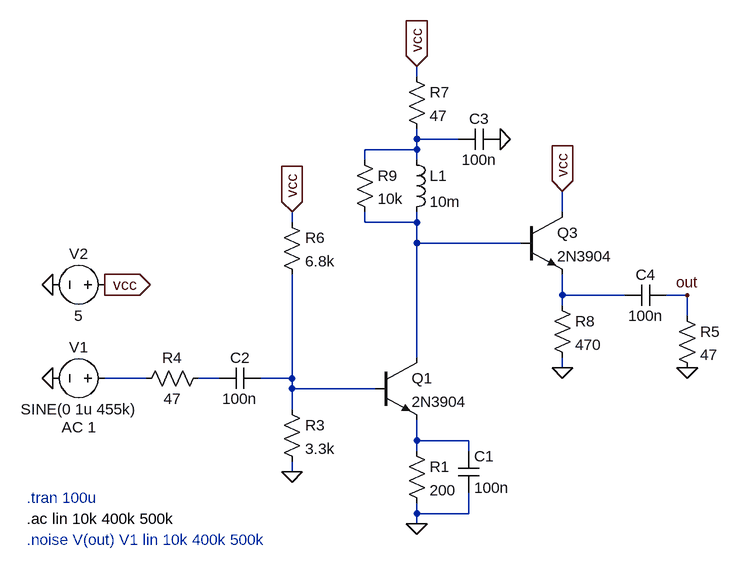
[diagram p0: schematic lc-tank.asc]
lc-tank.asc, the LTspice schematic file:
Version 4
SHEET 1 880 680
WIRE 160 -336 160 -352
WIRE 160 -240 160 -256
WIRE 224 -240 160 -240
WIRE 160 -224 160 -240
WIRE 160 -224 80 -224
WIRE 80 -208 80 -224
WIRE 160 -208 160 -224
WIRE 384 -128 384 -160
WIRE -32 -112 -32 -128
WIRE 80 -112 80 -128
WIRE 160 -112 160 -128
WIRE 160 -112 80 -112
WIRE 160 -80 160 -112
WIRE 320 -80 160 -80
WIRE 384 0 384 -32
WIRE 480 0 384 0
WIRE 576 0 544 0
WIRE 384 16 384 0
WIRE 576 32 576 0
WIRE 160 96 160 -80
WIRE 384 112 384 96
WIRE -256 128 -320 128
WIRE -144 128 -176 128
WIRE -32 128 -32 -32
WIRE -32 128 -80 128
WIRE -32 144 -32 128
WIRE 96 144 -32 144
WIRE -32 176 -32 144
WIRE 160 224 160 192
WIRE 240 224 160 224
WIRE 160 240 160 224
WIRE 240 240 240 224
WIRE -32 272 -32 256
WIRE 160 336 160 320
WIRE 240 336 240 304
WIRE 240 336 160 336
WIRE 160 352 160 336
FLAG 160 352 0
FLAG -32 272 0
FLAG -32 -128 vcc
IOPIN -32 -128 In
FLAG 160 -352 vcc
IOPIN 160 -352 In
FLAG -400 128 0
FLAG -400 -16 0
FLAG 576 112 0
FLAG 576 0 out
FLAG -320 -16 vcc
IOPIN -320 -16 Out
FLAG 384 -160 vcc
IOPIN 384 -160 In
FLAG 384 112 0
FLAG 288 -240 0
SYMBOL npn 96 96 R0
SYMATTR InstName Q1
SYMATTR Value 2N3904
SYMBOL res 144 224 R0
SYMATTR InstName R1
SYMATTR Value 200
SYMBOL cap 224 240 R0
SYMATTR InstName C1
SYMATTR Value 100n
SYMBOL res -48 160 R0
SYMATTR InstName R3
SYMATTR Value 3.3k
SYMBOL ind 144 -224 R0
SYMATTR InstName L1
SYMATTR Value 10m
SYMBOL cap -80 112 R90
WINDOW 0 0 32 VBottom 2
WINDOW 3 32 32 VTop 2
SYMATTR InstName C2
SYMATTR Value 100n
SYMBOL res -160 112 R90
WINDOW 0 0 56 VBottom 2
WINDOW 3 32 56 VTop 2
SYMATTR InstName R4
SYMATTR Value 47
SYMBOL voltage -304 128 R90
WINDOW 0 -32 56 VBottom 2
WINDOW 3 32 56 VTop 2
WINDOW 123 60 56 VTop 2
WINDOW 39 0 0 Left 0
SYMATTR InstName V1
SYMATTR Value SINE(0 1u 455k)
SYMATTR Value2 AC 1
SYMBOL voltage -304 -16 R90
WINDOW 0 -32 56 VBottom 2
WINDOW 3 32 56 VTop 2
WINDOW 123 0 0 Left 0
WINDOW 39 0 0 Left 0
SYMATTR InstName V2
SYMATTR Value 5
SYMBOL cap 544 -16 R90
WINDOW 0 0 32 VBottom 2
WINDOW 3 32 32 VTop 2
SYMATTR InstName C4
SYMATTR Value 100n
SYMBOL res 560 16 R0
SYMATTR InstName R5
SYMATTR Value 47
SYMBOL res -48 -128 R0
SYMATTR InstName R6
SYMATTR Value 6.8k
SYMBOL res 144 -352 R0
SYMATTR InstName R7
SYMATTR Value 47
SYMBOL npn 320 -128 R0
SYMATTR InstName Q3
SYMATTR Value 2N3904
SYMBOL res 368 0 R0
SYMATTR InstName R8
SYMATTR Value 470
SYMBOL res 64 -224 R0
SYMATTR InstName R9
SYMATTR Value 10k
SYMBOL cap 288 -256 R90
WINDOW 0 0 32 VBottom 2
WINDOW 3 32 32 VTop 2
SYMATTR InstName C3
SYMATTR Value 100n
TEXT -440 312 Left 2 ;.tran 100u
TEXT -440 344 Left 2 !.ac lin 10k 400k 500k
TEXT -440 376 Left 2 ;.noise V(out) V1 lin 10k 400k 500k

The netlist it stands for:
* lc-tank.asc
Q1 N002 N006 N007 0 2N3904
R1 N007 0 200
C1 N007 0 100n
R3 N006 0 3.3k
L1 N001 N002 10m
C2 N006 N005 100n
R4 N005 N004 47
V1 N004 0 SINE(0 1u 455k) AC 1
V2 vcc 0 5
C4 out N003 100n
R5 out 0 47
R6 vcc N006 6.8k
R7 vcc N001 47
Q3 vcc N002 N003 0 2N3904
R8 N003 0 470
R9 N001 N002 10k
C3 0 N001 100n
.model NPN NPN
.model PNP PNP
.lib standard.bjt
* .tran 100u
.ac lin 10k 400k 500k
* .noise V(out) V1 lin 10k 400k 500k
.backanno
.end